# Altium project Frequency_REF_Module.PrjPCB
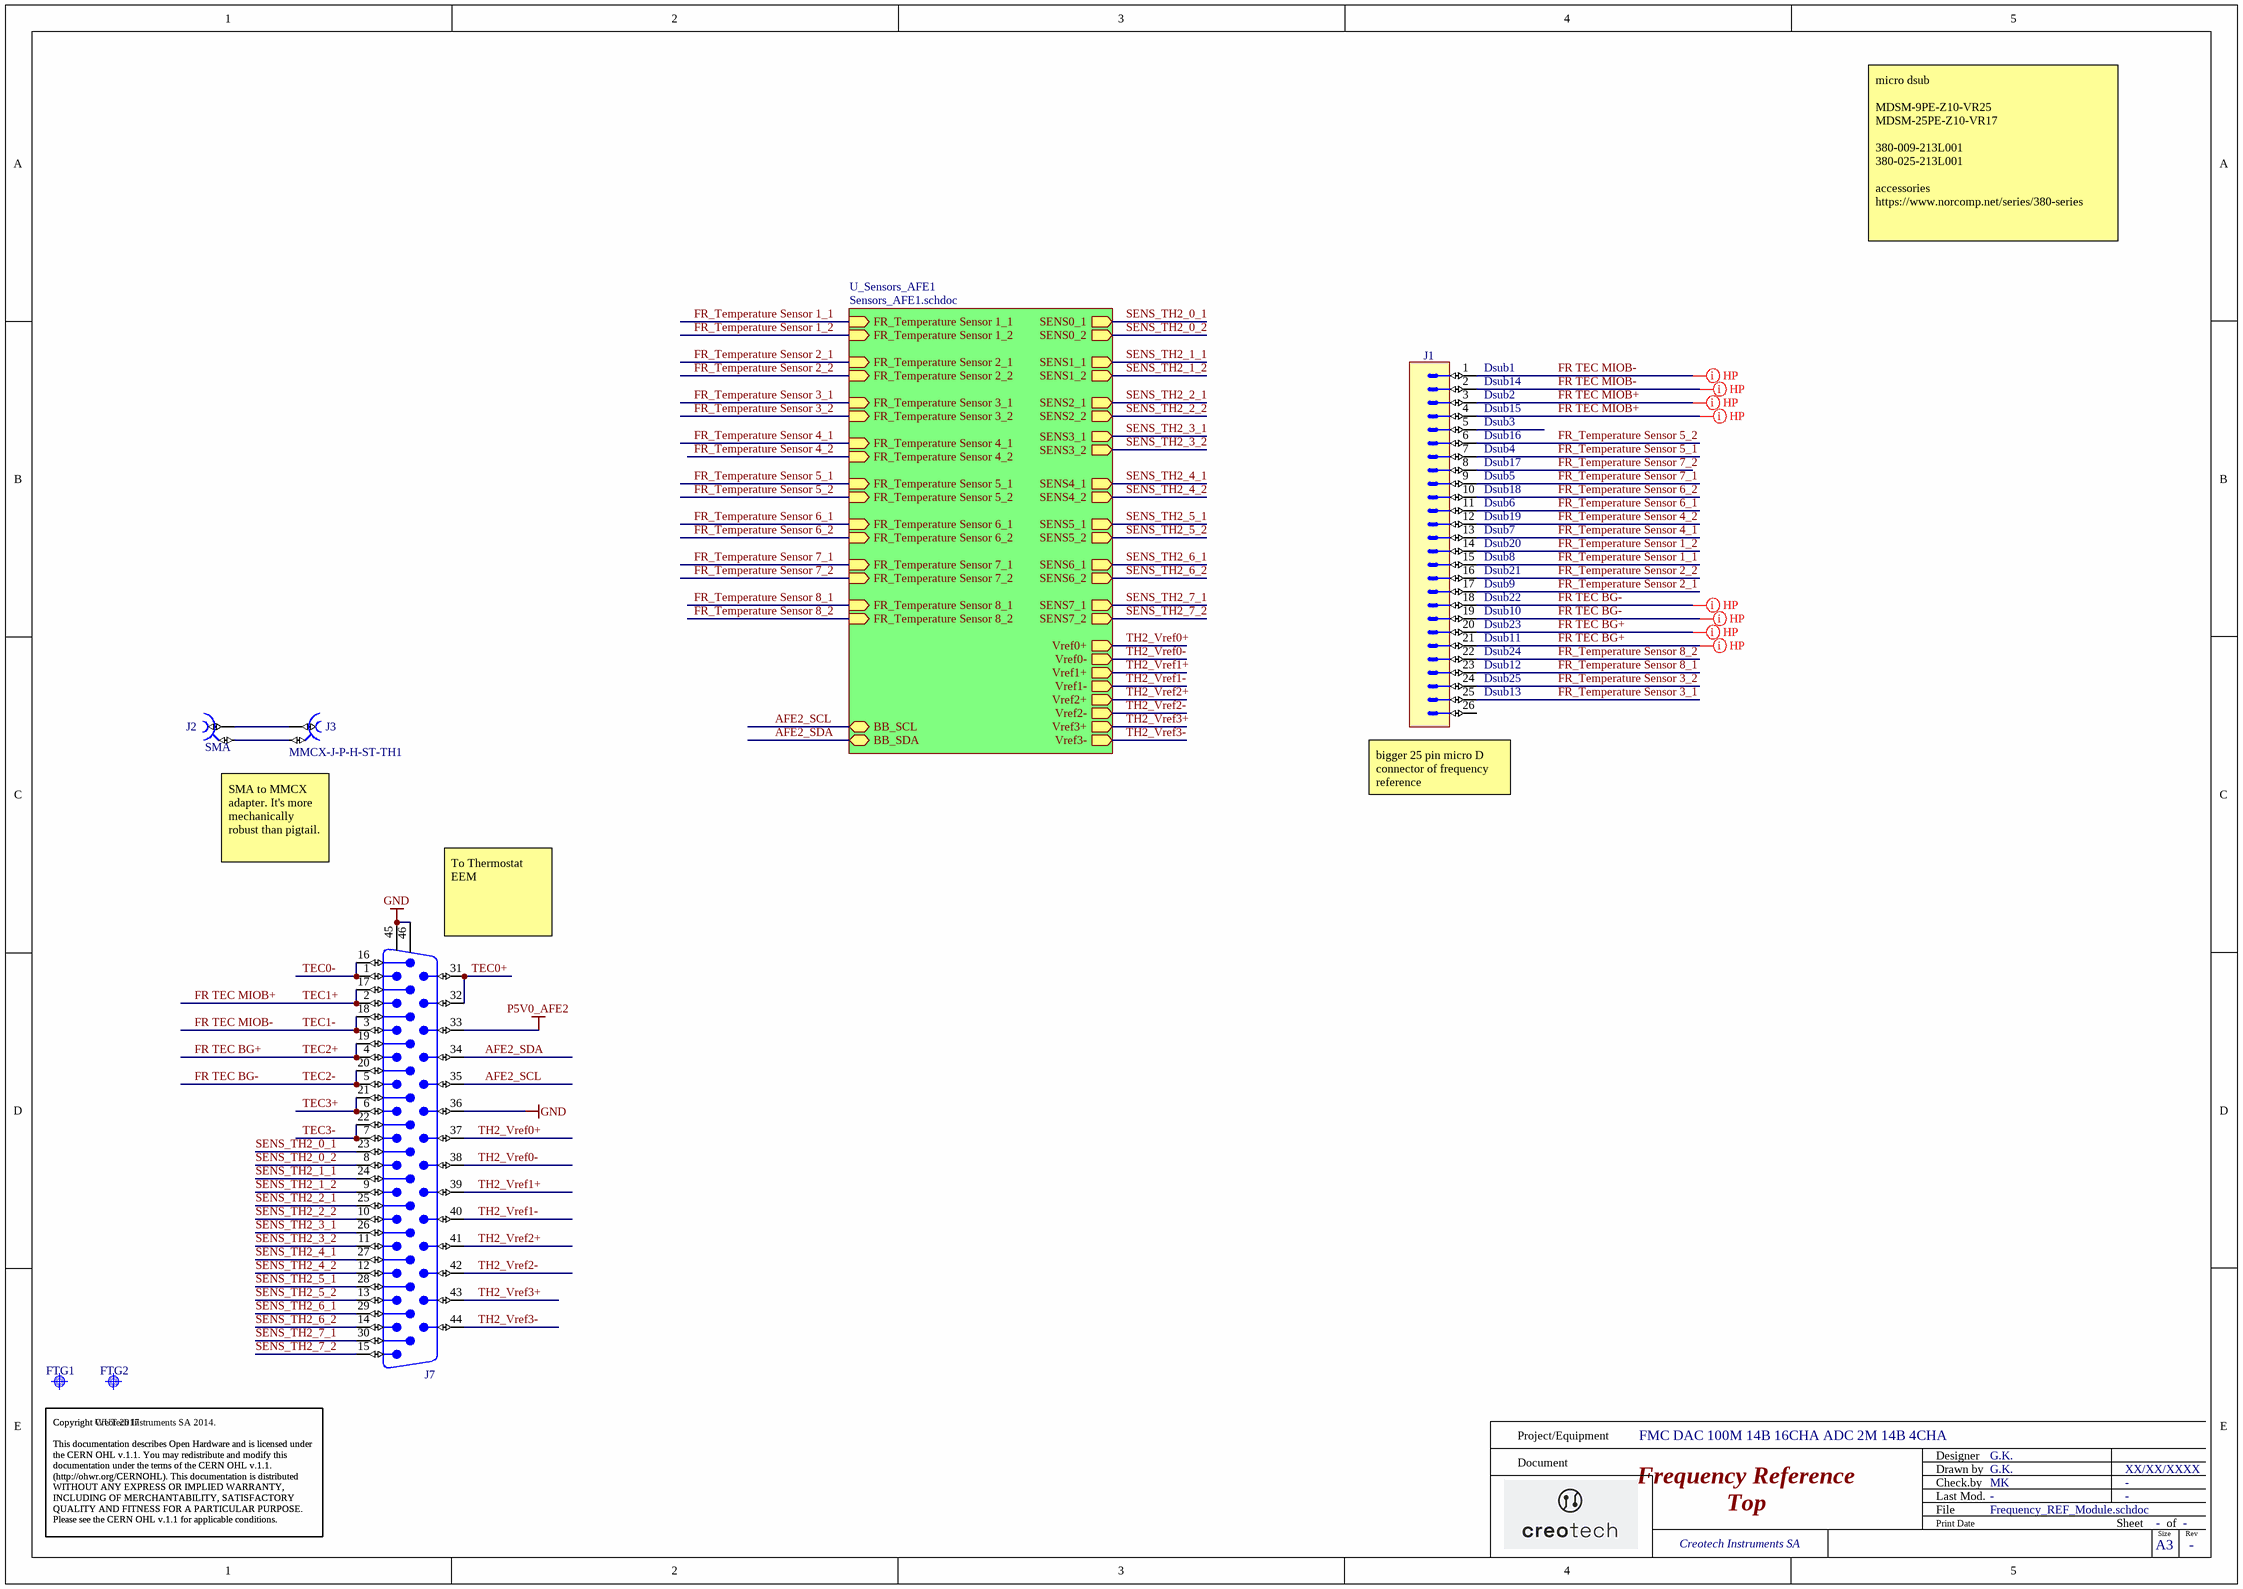
[diagram p0: Frequency_REF_Module.schdoc]
2 sheets, 49 parts. Net scope: hierarchical (ports join the sheet entries above them; power ports are global).
Board file: Frequency_REF_Module.PCBDOC
Sheets:
  Frequency_REF_Module.schdoc
    U_Sensors_AFE1 = Sensors_AFE1.schdoc

## Sheet Frequency_REF_Module.schdoc: Frequency Reference
size 420 x 297 mm; EDA_Number: ARTIQ; Projet: KASLI 3U subsystem; CheckedBy: MK; Author: G.K.; CompanyName: CREOTECH; DrawnBy: G.K.; Organization: CTI SA; Address1: Creotech Instruments SA; Address2: Okulickiego 7/9, 05-500 Poland; Revision: -; SheetNumber: -; SheetTotal: -; ModifiedBy: -; CreateDate: XX/XX/XXXX; CheckedDate: -; Title2: Top; DivGrp: CTI; Designer: G.K.; ModifiedDate: -; ProjectName: FMC DAC 100M 14B 16CHA ADC 2M 14B 4CHA

### Parts
FTG1  Use only in PCB  [FIDUCIAL_TOP_C100-200]  (value not drawn)
FTG2  Use only in PCB  [FIDUCIAL_TOP_S100-200]  (value not drawn)
J1  Header 26  [3M_N2526-6002RB]  (value not drawn)
J2  SMA  [DELOCK_65848]
J3  Manufacturer Part Number: MMCX-J-P-H-ST-TH1  [SAMTEC_MMCX-J-P-H-ST-TH1]  (hidden comment: Coax_1Female_1Shield)
J7  D-Sub  [AMPHENOL_10090926-P444XLF]  (value not drawn)

### Sub-sheets
U_Sensors_AFE1 = Sensors_AFE1.schdoc: SENS0_1 (out), SENS0_2 (out), SENS1_1 (out), SENS1_2 (out), SENS2_1 (out), SENS2_2 (out), SENS3_1 (out), SENS3_2 (out), SENS4_1 (out), SENS4_2 (out), SENS5_1 (out), SENS5_2 (out), SENS6_1 (out), SENS6_2 (out), SENS7_1 (out), SENS7_2 (out), Vref0+ (out), Vref0- (out), Vref1+ (out), Vref1- (out), Vref2+ (out), Vref2- (out), Vref3+ (out), Vref3- (out), BB_SCL (bidir), BB_SDA (bidir), FR_Temperature Sensor 1_2 (in), FR_Temperature Sensor 2_2 (in), FR_Temperature Sensor 1_1 (in), FR_Temperature Sensor 2_1 (in), FR_Temperature Sensor 3_1 (in), FR_Temperature Sensor 3_2 (in), FR_Temperature Sensor 4_1 (in), FR_Temperature Sensor 4_2 (in), FR_Temperature Sensor 5_1 (in), FR_Temperature Sensor 5_2 (in), FR_Temperature Sensor 6_1 (in), FR_Temperature Sensor 6_2 (in), FR_Temperature Sensor 7_1 (in), FR_Temperature Sensor 7_2 (in), FR_Temperature Sensor 8_1 (in), FR_Temperature Sensor 8_2 (in)

### Nets
GND: J7.36 J7.45 J7.46
P5V0_AFE2: J7.33
AFE2_SCL: J7.35 ; sheet U_Sensors_AFE1/BB_SCL
AFE2_SDA: J7.34 ; sheet U_Sensors_AFE1/BB_SDA
FR TEC BG+: J1.20 J1.21 J7.4 J7.19  [also labelled TEC2+]
FR TEC BG-: J1.18 J1.19 J7.5 J7.20  [also labelled TEC2-]
FR TEC MIOB+: J1.3 J1.4 J7.2 J7.17  [also labelled TEC1+]
FR TEC MIOB-: J1.1 J1.2 J7.3 J7.18  [also labelled TEC1-]
FR_Temperature Sensor 1_1: J1.15 J7.23 ; sheet U_Sensors_AFE1/SENS0_1, sheet U_Sensors_AFE1/FR_Temperature Sensor 1_1  [also labelled SENS_TH2_0_1]
FR_Temperature Sensor 1_2: J1.14 J7.8 ; sheet U_Sensors_AFE1/SENS0_2, sheet U_Sensors_AFE1/FR_Temperature Sensor 1_2  [also labelled SENS_TH2_0_2]
FR_Temperature Sensor 2_1: J1.17 J7.24 ; sheet U_Sensors_AFE1/SENS1_1, sheet U_Sensors_AFE1/FR_Temperature Sensor 2_1  [also labelled SENS_TH2_1_1]
FR_Temperature Sensor 2_2: J1.16 J7.9 ; sheet U_Sensors_AFE1/SENS1_2, sheet U_Sensors_AFE1/FR_Temperature Sensor 2_2  [also labelled SENS_TH2_1_2]
FR_Temperature Sensor 3_1: J1.25 J7.25 ; sheet U_Sensors_AFE1/SENS2_1, sheet U_Sensors_AFE1/FR_Temperature Sensor 3_1  [also labelled SENS_TH2_2_1]
FR_Temperature Sensor 3_2: J1.24 J7.10 ; sheet U_Sensors_AFE1/SENS2_2, sheet U_Sensors_AFE1/FR_Temperature Sensor 3_2  [also labelled SENS_TH2_2_2]
FR_Temperature Sensor 4_1: J1.13 J7.26 ; sheet U_Sensors_AFE1/SENS3_1, sheet U_Sensors_AFE1/FR_Temperature Sensor 4_1  [also labelled SENS_TH2_3_1]
FR_Temperature Sensor 4_2: J1.12 J7.11 ; sheet U_Sensors_AFE1/SENS3_2, sheet U_Sensors_AFE1/FR_Temperature Sensor 4_2  [also labelled SENS_TH2_3_2]
FR_Temperature Sensor 5_1: J1.7 J7.27 ; sheet U_Sensors_AFE1/SENS4_1, sheet U_Sensors_AFE1/FR_Temperature Sensor 5_1  [also labelled SENS_TH2_4_1]
FR_Temperature Sensor 5_2: J1.6 J7.12 ; sheet U_Sensors_AFE1/SENS4_2, sheet U_Sensors_AFE1/FR_Temperature Sensor 5_2  [also labelled SENS_TH2_4_2]
FR_Temperature Sensor 6_1: J1.11 J7.28 ; sheet U_Sensors_AFE1/SENS5_1, sheet U_Sensors_AFE1/FR_Temperature Sensor 6_1  [also labelled SENS_TH2_5_1]
FR_Temperature Sensor 6_2: J1.10 J7.13 ; sheet U_Sensors_AFE1/SENS5_2, sheet U_Sensors_AFE1/FR_Temperature Sensor 6_2  [also labelled SENS_TH2_5_2]
FR_Temperature Sensor 7_1: J1.9 J7.29 ; sheet U_Sensors_AFE1/SENS6_1, sheet U_Sensors_AFE1/FR_Temperature Sensor 7_1  [also labelled SENS_TH2_6_1]
FR_Temperature Sensor 7_2: J1.8 J7.14 ; sheet U_Sensors_AFE1/SENS6_2, sheet U_Sensors_AFE1/FR_Temperature Sensor 7_2  [also labelled SENS_TH2_6_2]
FR_Temperature Sensor 8_1: J1.23 J7.30 ; sheet U_Sensors_AFE1/SENS7_1, sheet U_Sensors_AFE1/FR_Temperature Sensor 8_1  [also labelled SENS_TH2_7_1]
FR_Temperature Sensor 8_2: J1.22 J7.15 ; sheet U_Sensors_AFE1/SENS7_2, sheet U_Sensors_AFE1/FR_Temperature Sensor 8_2  [also labelled SENS_TH2_7_2]
TEC0+: J7.31 J7.32
TEC0-: J7.1 J7.16
TEC3+: J7.6 J7.21
TEC3-: J7.7 J7.22
TH2_Vref0+: J7.37 ; sheet U_Sensors_AFE1/Vref0+
TH2_Vref0-: J7.38 ; sheet U_Sensors_AFE1/Vref0-
TH2_Vref1+: J7.39 ; sheet U_Sensors_AFE1/Vref1+
TH2_Vref1-: J7.40 ; sheet U_Sensors_AFE1/Vref1-
TH2_Vref2+: J7.41 ; sheet U_Sensors_AFE1/Vref2+
TH2_Vref2-: J7.42 ; sheet U_Sensors_AFE1/Vref2-
TH2_Vref3+: J7.43 ; sheet U_Sensors_AFE1/Vref3+
TH2_Vref3-: J7.44 ; sheet U_Sensors_AFE1/Vref3-
NetJ2_1: J2.1 J3.1
NetJ2_2: J2.2 J3.2

Not connected (* = marked no-connect by the designer): J1 5 26

### Layout directives
net class HP: FR TEC BG+, FR TEC BG-, FR TEC MIOB+, FR TEC MIOB-

### Notes on the sheet
- micro dsub
  MDSM-9PE-Z10-VR25
  MDSM-25PE-Z10-VR17
  380-009-213L001
  380-025-213L001
  accessories
  https://www.norcomp.net/series/380-series
- (near J1) Dsub1
- (near J1) Dsub2
- (near J1) Dsub14
- (near J1) Dsub3
- (near J1) Dsub4
- (near J1) Dsub15
- (near J1) Dsub16
- (near J1) Dsub5
- (near J1) Dsub6
- (near J1) Dsub7
- (near J1) Dsub17
- (near J1) Dsub18
- (near J1) Dsub19
- (near J1) Dsub8
- (near J1) Dsub9
- (near J1) Dsub20
- (near J1) Dsub21
- (near J1) Dsub10
- (near J1) Dsub11
- (near J1) Dsub12
- (near J1) Dsub22
- (near J1) Dsub23
- (near J1) Dsub24
- (near J1) Dsub13
- (near J1) Dsub25
- (near J1) bigger 25 pin micro D connector of frequency reference
- SMA to MMCX adapter. It's more mechanically robust than pigtail.
- (near J7) To Thermostat EEM
- Copyright WUT 2017
  This documentation describes Open Hardware and is licensed under the CERN OHL v.1.1. You may redistribute and modify this documentation under the terms of the CERN OHL v.1.1. (http://ohwr.org/CERNOHL). This documentation is distributed WITHOUT ANY EXPRESS OR IMPLIED WARRANTY, INCLUDING OF MERCHANTABILITY, SATISFACTORY QUALITY AND FITNESS FOR A PARTICULAR PURPOSE. Please see the CERN OHL v.1.1 for applicable conditions.
- Project/Equipment
- Document
- Designer
- Drawn by
- Check.by
- Copyright Creotech Instruments SA 2014.
  This documentation describes Open Hardware and is licensed under the CERN OHL v.1.1. You may redistribute and modify this documentation under the terms of the CERN OHL v.1.1. (http://ohwr.org/CERNOHL). This documentation is distributed WITHOUT ANY EXPRESS OR IMPLIED WARRANTY, INCLUDING OF MERCHANTABILITY, SATISFACTORY QUALITY AND FITNESS FOR A PARTICULAR PURPOSE. Please see the CERN OHL v.1.1 for applicable conditions.
- File
- Last Mod.
- Print Date
- Sheet
- Size
- A3
- of
- Rev

### Library data of the parts
FTG1 = FIDUCIAL_TARGET_C100-200: Fiducial Target; Part Description: Round Fiducial Target, Top Layer, 1.0mm, Top Solder 2.0mm, Keepout =2.0mm; Mounted: No; Part Number: FIDUCIAL_TARGET_C100-200; Component Kind: Standard (No BOM); Component Type: Standard (No BOM); Pin Count: 1; Family: Fiducial; Socket: No; SMD: Yes; Sense: No; Status: None; ComponentHeight: 0mm; HelpURL: Undefined; Author: CERN DEM JLC; CreateDate: 09.02.2010; LatestRevisionDate: 04.04.2012; PackageDescription: Round Fiducial Target, Top Layer, 1.0mm, Top Solder 2.0mm, Keepout =2.0mm
FTG2 = FIDUCIAL_TARGET_S100-200: Fiducial Target; Part Description: Square Fiducial Target, Top Layer, 1.0mm, Top Solder 2.0mm, Keepout =2.0mm; Mounted: No; Part Number: FIDUCIAL_TARGET_S100-200; Component Kind: Standard (No BOM); Component Type: Standard (No BOM); Pin Count: 1; Family: Fiducial; Socket: No; SMD: Yes; Sense: No; Status: None; ComponentHeight: 0mm; HelpURL: Undefined; Author: CERN DEM JLC; CreateDate: 09.02.2010; LatestRevisionDate: 04.04.2012; PackageDescription: Square Fiducial Target, Top Layer, 1.0mm, Top Solder 2.0mm, Keepout =2.0mm
J1 = 3M_N2526-6002RB: Connector 26 Male; Part Description: 26 Contacts, Straight .100'' x .100'' Low Profile Four-Wall Header, 2500 Series; Manufacturer: 3M; PressFit: No; Part Number: 3M_N2526-6002RB; Component Kind: Standard; Component Type: Standard; Pin Count: 26; Family: Header 26; Mounted: Yes; Socket: No; SMD: No; Sense: No; Status: None; Manufacturer Part Number: N2526-6002RB; ComponentHeight: 10.03mm; HelpURL: \\cern.ch\dfs\Applications\Altium\Datasheets\3M_N2526-6002RB.pdf; Author: CERN DEM JLC; CreateDate: 11.02.2009; LatestRevisionDate: 11.08.2009
J2 = CON_SMA_DELOCK_65848: 50 Ohm Through Hole SMA Right Angle PCB Jack; Manufacturer: DELOCK; Manufacturer Part Number: 5848 (4043619658480); PressFit: No; Part Number: DELOCK_65848; Component Kind: Standard; Component Type: Standard; Pin Count: 5; Family: SMA; Mounted: Yes; Socket: No; SMD: No; Sense: No; Status: None; Part Description: 50 Ohm Through Hole SMA Right Angle PCB Jack; ComponentHeight: 12.5; HelpURL: \\cern.ch\dfs\Applications\Altium\Datasheets\AMPHENOL_132203-16.pdf; Author: GK; CreateDate: 13.05.2019; LatestRevisionDate: 13.05.2019
J3 = SAMTEC_MMCX-J-P-H-ST-TH1: Part Description: Straight Through-hole 50 Ohm Micro Mini RF Jack, MMCX Series; Manufacturer: SAMTEC; PressFit: No; Part Number: SAMTEC_MMCX-J-P-H-ST-TH1; Component Kind: Standard; Component Type: Standard; Pin Count: 2; Mounted: Yes; Socket: No; SMD: No; Sense: No; Status: None; ComponentHeight: 4.35mm; HelpURL: \\cern.ch\dfs\Applications\Altium\Datasheets\SAMTEC_MMCX-J-P-H-ST-TH1.pdf; Author: CERN DEM JLC; CreateDate: 05.12.2012; LatestRevisionDate: 05.12.2012
J7 = AMPHENOL_10090926-P444XLF: Connector D-sub 44 Male; Part Description: Right Angle High Density D-sub 44 Male Contacts with Harpoons + UNC 4-40 Clinchnuts + Electrical Continuity; PressFit: No; Part Number: AMPHENOL_10090926-P444XLF; Component Kind: Standard; Component Type: Standard; Pin Count: 46; Family: D-Sub; Mounted: Yes; Socket: No; SMD: No; Sense: No; Status: None; Manufacturer: AMPHENOL; Manufacturer Part Number: 10090926-P444XLF; ComponentHeight: 12.8mm; HelpURL: \\cern.ch\dfs\Applications\Altium\Datasheets\AMPHENOL_10090926-P444XLF.pdf; Author: CERN DEM BC; CreateDate: 22.10.2020; LatestRevisionDate: 22.10.2020

## Sheet Sensors_AFE1.schdoc: FR sensors
size 420 x 297 mm; EDA_Number: ARTIQ; Projet: KASLI 3U subsystem; CheckedBy: MK; Author: G.K.; CompanyName: CREOTECH; DrawnBy: G.K.; Organization: CTI SA; Address1: Creotech Instruments SA; Address2: Okulickiego 7/9, 05-500 Poland; Revision: -; SheetNumber: -; SheetTotal: -; ModifiedBy: -; CreateDate: XX/XX/XXXX; CheckedDate: -; DivGrp: CTI; Designer: G.K.; ModifiedDate: -; ProjectName: FMC DAC 100M 14B 16CHA ADC 2M 14B 4CHA
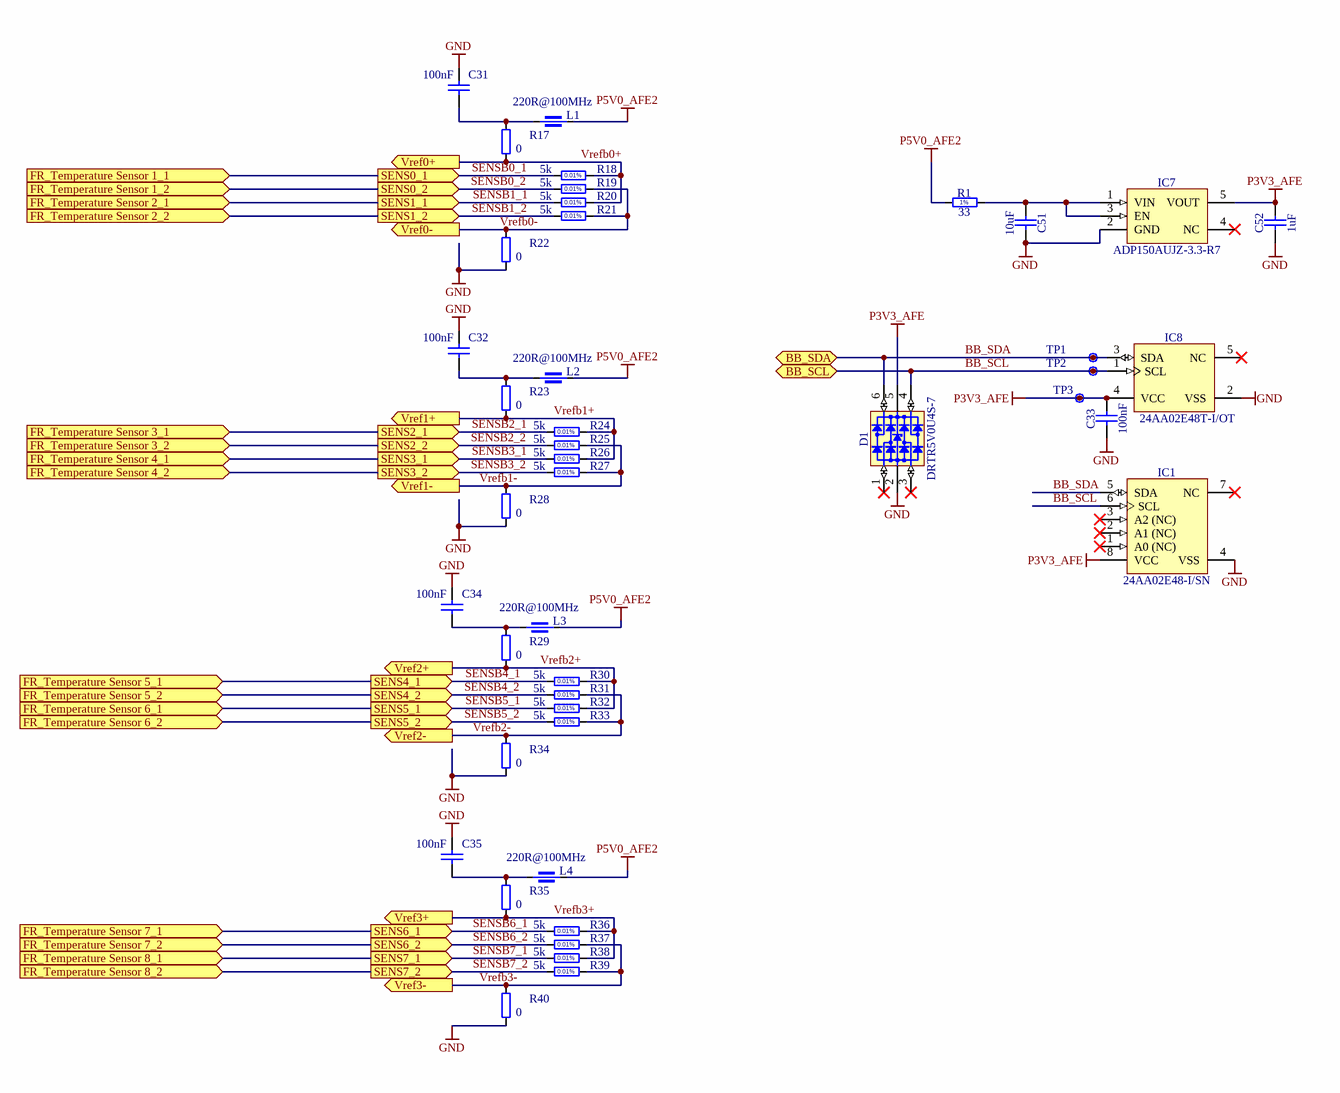
[diagram p1: Sensors_AFE1.schdoc]

### Parts
C31  100nF  [CAPC1005X55N]
C32  100nF  [CAPC1005X55N]
C33  100nF  [CAPC1005X55N]
C34  100nF  [CAPC1005X55N]
C35  100nF  [CAPC1005X55N]
C51  10uF  [CAPC2012X135N]
C52  1uF  [CAPC1608X87N]
D1  DRTR5V0U4S-7  [SOT65P210X110-6N]
IC1  24AA02E48-I/SN  [SOIC127P600X175-8N]
IC7  ADP150AUJZ-3.3-R7  [SOT95P280X90-5N]
IC8  24AA02E48T-I/OT  [SOT95P280X145-5N]
L1  220R@100MHz  [INDC1005X55N]
L2  220R@100MHz  [INDC1005X55N]
L3  220R@100MHz  [INDC1005X55N]
L4  220R@100MHz  [INDC1005X55N]
R1  33  [RESC1005X40N]
R17  0  [RESC1608X55N]
R18  5k  [RESC2013X64N]
R19  5k  [RESC2013X64N]
R20  5k  [RESC2013X64N]
R21  5k  [RESC2013X64N]
R22  0  [RESC1608X55N]
R23  0  [RESC1608X55N]
R24  5k  [RESC2013X64N]
R25  5k  [RESC2013X64N]
R26  5k  [RESC2013X64N]
R27  5k  [RESC2013X64N]
R28  0  [RESC1608X55N]
R29  0  [RESC1608X55N]
R30  5k  [RESC2013X64N]
R31  5k  [RESC2013X64N]
R32  5k  [RESC2013X64N]
R33  5k  [RESC2013X64N]
R34  0  [RESC1608X55N]
R35  0  [RESC1608X55N]
R36  5k  [RESC2013X64N]
R37  5k  [RESC2013X64N]
R38  5k  [RESC2013X64N]
R39  5k  [RESC2013X64N]
R40  0  [RESC1608X55N]
TP1  Test Point  [TPS127]  (value not drawn)
TP2  Test Point  [TPS127]  (value not drawn)
TP3  Test Point  [TPS127]  (value not drawn)

### Ports
BB_SCL (bidir), BB_SDA (bidir), FR_Temperature Sensor 1_1 (in), FR_Temperature Sensor 1_2 (in), FR_Temperature Sensor 2_1 (in), FR_Temperature Sensor 2_2 (in), FR_Temperature Sensor 3_1 (in), FR_Temperature Sensor 3_2 (in), FR_Temperature Sensor 4_1 (in), FR_Temperature Sensor 4_2 (in), FR_Temperature Sensor 5_1 (in), FR_Temperature Sensor 5_2 (in), FR_Temperature Sensor 6_1 (in), FR_Temperature Sensor 6_2 (in), FR_Temperature Sensor 7_1 (in), FR_Temperature Sensor 7_2 (in), FR_Temperature Sensor 8_1 (in), FR_Temperature Sensor 8_2 (in), SENS0_1 (out), SENS0_2 (out), SENS1_1 (out), SENS1_2 (out), SENS2_1 (out), SENS2_2 (out), SENS3_1 (out), SENS3_2 (out), SENS4_1 (out), SENS4_2 (out), SENS5_1 (out), SENS5_2 (out), SENS6_1 (out), SENS6_2 (out), SENS7_1 (out), SENS7_2 (out), Vref0+ (out), Vref0- (out), Vref1+ (out), Vref1- (out), Vref2+ (out), Vref2- (out), Vref3+ (out), Vref3- (out)

### Nets
GND: C31.1 C32.1 C33.1 C34.1 C35.1 C51.2 C52.1 D1.2(GND) IC1.4(VSS) IC7.2(GND) IC8.2(VSS) R22.1 R28.1 R34.1 R40.1
P3V3_AFE: C33.2 C52.2 D1.5(VBUS) IC1.8(VCC) IC7.5(VOUT) IC8.4(VCC) TP3.1
P5V0_AFE2: L1.2 L2.2 L3.2 L4.2 R1.1
BB_SCL: D1.4(I/O3) IC1.6(SCL) IC8.1(SCL) TP2.1 ; port BB_SCL  [project net AFE2_SCL]
BB_SDA: D1.6(I/O4) IC1.5(SDA) IC8.3(SDA) TP1.1 ; port BB_SDA  [project net AFE2_SDA]
SENSB0_1: R18.1 ; port SENS0_1, port FR_Temperature Sensor 1_1  [project net FR_Temperature Sensor 1_1]
SENSB0_2: R19.1 ; port SENS0_2, port FR_Temperature Sensor 1_2  [project net FR_Temperature Sensor 1_2]
SENSB1_1: R20.1 ; port SENS1_1, port FR_Temperature Sensor 2_1  [project net FR_Temperature Sensor 2_1]
SENSB1_2: R21.1 ; port SENS1_2, port FR_Temperature Sensor 2_2  [project net FR_Temperature Sensor 2_2]
SENSB2_1: R24.1 ; port SENS2_1, port FR_Temperature Sensor 3_1  [project net FR_Temperature Sensor 3_1]
SENSB2_2: R25.1 ; port SENS2_2, port FR_Temperature Sensor 3_2  [project net FR_Temperature Sensor 3_2]
SENSB3_1: R26.1 ; port SENS3_1, port FR_Temperature Sensor 4_1  [project net FR_Temperature Sensor 4_1]
SENSB3_2: R27.1 ; port SENS3_2, port FR_Temperature Sensor 4_2  [project net FR_Temperature Sensor 4_2]
SENSB4_1: R30.1 ; port SENS4_1, port FR_Temperature Sensor 5_1  [project net FR_Temperature Sensor 5_1]
SENSB4_2: R31.1 ; port SENS4_2, port FR_Temperature Sensor 5_2  [project net FR_Temperature Sensor 5_2]
SENSB5_1: R32.1 ; port SENS5_1, port FR_Temperature Sensor 6_1  [project net FR_Temperature Sensor 6_1]
SENSB5_2: R33.1 ; port SENS5_2, port FR_Temperature Sensor 6_2  [project net FR_Temperature Sensor 6_2]
SENSB6_1: R36.1 ; port SENS6_1, port FR_Temperature Sensor 7_1  [project net FR_Temperature Sensor 7_1]
SENSB6_2: R37.1 ; port SENS6_2, port FR_Temperature Sensor 7_2  [project net FR_Temperature Sensor 7_2]
SENSB7_1: R38.1 ; port SENS7_1, port FR_Temperature Sensor 8_1  [project net FR_Temperature Sensor 8_1]
SENSB7_2: R39.1 ; port SENS7_2, port FR_Temperature Sensor 8_2  [project net FR_Temperature Sensor 8_2]
Vrefb0+: R17.1 R18.2 R20.2 ; port Vref0+  [project net TH2_Vref0+]
Vrefb0-: R19.2 R21.2 R22.2 ; port Vref0-  [project net TH2_Vref0-]
Vrefb1+: R23.1 R24.2 R26.2 ; port Vref1+  [project net TH2_Vref1+]
Vrefb1-: R25.2 R27.2 R28.2 ; port Vref1-  [project net TH2_Vref1-]
Vrefb2+: R29.1 R30.2 R32.2 ; port Vref2+  [project net TH2_Vref2+]
Vrefb2-: R31.2 R33.2 R34.2 ; port Vref2-  [project net TH2_Vref2-]
Vrefb3+: R35.1 R36.2 R38.2 ; port Vref3+  [project net TH2_Vref3+]
Vrefb3-: R37.2 R39.2 R40.2 ; port Vref3-  [project net TH2_Vref3-]
NetC31_2: C31.2 L1.1 R17.2
NetC32_2: C32.2 L2.1 R23.2
NetC34_2: C34.2 L3.1 R29.2
NetC35_2: C35.2 L4.1 R35.2
NetC51_1: C51.1 IC7.1(VIN) IC7.3(EN) R1.2

Not connected (* = marked no-connect by the designer): D1 1(I/O1)* 3(I/O2)*; IC1 1(A0_(NC))* 2(A1_(NC))* 3(A2_(NC))* 7(NC)*; IC7 4(NC)*; IC8 5(NC)*

### Notes on the sheet
- Project/Equipment
- Document
- Designer
- Drawn by
- Check.by
- Copyright Creotech Instruments SA 2014.
  This documentation describes Open Hardware and is licensed under the CERN OHL v.1.1. You may redistribute and modify this documentation under the terms of the CERN OHL v.1.1. (http://ohwr.org/CERNOHL). This documentation is distributed WITHOUT ANY EXPRESS OR IMPLIED WARRANTY, INCLUDING OF MERCHANTABILITY, SATISFACTORY QUALITY AND FITNESS FOR A PARTICULAR PURPOSE. Please see the CERN OHL v.1.1 for applicable conditions.
- File
- Last Mod.
- Print Date
- Sheet
- Size
- A3
- of
- Rev
- (in symbol R0402_33R_1%_0.0625W_100PPM) 1%
- (in symbol R0805_5K_0.01%_0.2W_0.2PPM_VISHAY_VSMP) 0.01%

### Library data of the parts
C31-C35 = CC0402_100NF_16V_10%_X5R: Non-polarised capacitor; Part Description: SMD Multilayer Chip Ceramic Capacitor; Manufacturer: GENERIC; Manufacturer1 Part Number: GRM155R61C104KA88D; Voltage: 16V; TC: X5R; Tolerance: ±10%; Part Number: CC0402_100NF_16V_10%_X5R; Component Kind: Standard; Component Type: Standard; Pin Count: 2; Value: 100nF; Status: None; Manufacturer Part Number: CC0402_100NF_16V_10%_X5R; Case: 0402; Mounted: Yes; Socket: No; SMD: Yes; Sense: No; Manufacturer1 Example: MURATA; Manufacturer1 ComponentHeight: 0.55mm; HelpURL: \\cern.ch\dfs\Applications\Altium\Datasheets\CC0402_X5R_MURATA_GRM.pdf; Author: CERN DEM JLC; CreateDate: 10.12.2013; LatestRevisionDate: 10.12.2013
C51 = CC0805_10UF_16V_10%_X5R: Non-polarised capacitor; Part Description: SMD Multilayer Chip Ceramic Capacitor; Manufacturer: GENERIC; Manufacturer1 Part Number: C0805C106K4PAC; Voltage: 16V; TC: X5R; Tolerance: ±10%; Part Number: CC0805_10UF_16V_10%_X5R; Component Kind: Standard; Component Type: Standard; Pin Count: 2; Value: 10uF; Status: Preferred; Manufacturer Part Number: CC0805_10UF_16V_10%_X5R; Case: 0805; Mounted: Yes; Socket: No; SMD: Yes; Manufacturer1 Example: KEMET; Manufacturer1 ComponentHeight: 1.4mm; HelpURL: \\cern.ch\dfs\Applications\Altium\Datasheets\CC1206_X5R_KEMET.pdf; Author: CERN DEM JLC; CreateDate: 03.12.2007; LatestRevisionDate: 03.12.2007; Sense: No
C52 = CC0603_1UF_25V_10%_X7R: Non-polarised capacitor; Part Description: SMD Multilayer Chip Ceramic Capacitor; Manufacturer: GENERIC; Manufacturer1 Part Number: GRM188R71E105KA12D; Voltage: 25V; TC: X7R; Tolerance: ±10%; Part Number: CC0603_1UF_25V_10%_X7R; Component Kind: Standard; Component Type: Standard; Pin Count: 2; Value: 1uF; Status: None; Manufacturer Part Number: CC0603_1UF_25V_10%_X7R; Case: 0603; Mounted: Yes; Socket: No; SMD: Yes; Sense: No; Manufacturer1 Example: MURATA; Manufacturer1 ComponentHeight: 0.9mm; HelpURL: \\cern.ch\dfs\Applications\Altium\Datasheets\CC0603_X7R_MURATA.pdf; Author: CERN DEM JLC; CreateDate: 18/01/2011; LatestRevisionDate: 18/01/2011
D1 = D_TVS_DRTR5V0U4S-7: Integrated Quad Ultra-Low Capacitance ESD Protection; Part Description: Integrated Quad Ultra-Low Capacitance ESD (±8kV) Protection; Manufacturer: DIODES; PressFit: No; Bonding: No; Status Comment: Active; Part Number: DRTR5V0U4S-7; Component Kind: Standard; Component Type: Standard; Device: DRTR5V0U4S-7; PackageDescription: SOT363, SC70-6, 0.65mm Pitch; 6 Pin, 1.25mm W X 2.00mm L X 1.10mm H body, IPC Medium Density; Status: Active; Manufacturer Part Number: DRTR5V0U4S-7; Pin Count: 6; Case: SOT363; Mounted: Yes; Socket: No; SMD: Yes; Sense: No; ComponentHeight: 1.1mm; HelpURL: \\cern.ch\dfs\Applications\Altium\Datasheets\PRTR5V0U4Y.pdf; Author: GK; CreateDate: 24.01.2017; LatestRevisionDate: 14.09.2020
IC1 = MEM_24AA02E48-I/SN: 1.7V-5.5V, 2K I2C™ Serial EEPROMs with EUI-48™ Node Identity; Manufacturer: MICROCHIP TECHNOLOGY; PressFit: No; Bonding: No; Part Number: 24AA02E48-I/SN; Component Kind: Standard; Component Type: Standard; Device: 24AA02E48-I/SN; PackageDescription: SOIC, 1.27mm Pitch; 8 Pin - Body 4x5mm, IPC Medium Density; Part Description: 1.7V-5.5V, 2K I2C™ Serial EEPROMs with EUI-48™ Node Identity; Manufacturer Part Number: 24AA02E48-I/SN; Pin Count: 8; Case: SOIC8; Mounted: Yes; Socket: No; SMD: Yes; Sense: No; ComponentHeight: 1.75mm; HelpURL: \\cern.ch\dfs\Applications\Altium\Datasheets\24AA025E48-I-SN.pdf; Author: CERN DEM MR; CreateDate: 19.07.2016; LatestRevisionDate: 19.07.2016
IC7 = ADP150AUJZ-3.3-R7: Ultralow Noise, 150 mA CMOS Linear Regulator; Part Description: 3.3V, 150mA, Ultralow Noise, CMOS Linear Regulator; Manufacturer: ANALOG DEVICES; PressFit: No; Bonding: No; Part Number: ADP150AUJZ-3.3-R7; Component Kind: Standard; Component Type: Standard; Device: ADP150AUJZ-3.3-R7; PackageDescription: SOT23, 0.95mm pitch; 5 pin, 1.75mm W X 3.00mm L, IPC Medium Density; Manufacturer Part Number: ADP150AUJZ-3.3-R7; Pin Count: 5; Case: SOT23; Mounted: Yes; Socket: No; SMD: Yes; Sense: No; ComponentHeight: 0.9mm; HelpURL: \\cern.ch\dfs\Applications\Altium\Datasheets\ADP150AUJZ-3.3-R7.pdf; Author: CERN DEM JLC; CreateDate: 27/09/2011; LatestRevisionDate: 19/06/2014
IC8 = 24AA02E48T-I/OT: 1.7V-5.5V, 2K I2C Serial EEPROM With EUI-48 Node Identity; Manufacturer: MICROCHIP TECHNOLOGY; PressFit: No; Bonding: No; Part Number: 24AA02E48T-I/OT; Component Kind: Standard; Component Type: Standard; Device: 24AA02E48T-I/OT; PackageDescription: SOT, 0.95mm pitch; 5 pin, 1.60mm W X 2.90mm L X 1.45mm H body, IPC Medium Density; Part Description: 1.7V-5.5V, 2K I2C Serial EEPROM With EUI-48 Node Identity; Manufacturer Part Number: 24AA02E48T-I/OT; Pin Count: 5; Case: SOT23-5; Mounted: Yes; Socket: No; SMD: Yes; Sense: No; ComponentHeight: 1.45mm; HelpURL: \\cern.ch\dfs\Applications\Altium\Datasheets\24AA02E48T-I-OT.pdf; Author: CERN DEM MR; CreateDate: 31.03.2016; LatestRevisionDate: 31.03.2016
L1-L4 = IND0402_MURATA_BLM15HB221SN1: Part Description: SMD EMIFIL Suppression Chip Ferrite Bead; Manufacturer: MURATA; Power: 250mA; Resistance: 1R; Tolerance: ±25%; Part Number: IND0402_MURATA_BLM15HB221SN1; Component Kind: Standard; Component Type: Standard; Pin Count: 2; Value: 220R@100MHz; Status: None; Manufacturer Part Number: BLM15HB221SN1; Case: 0402; Mounted: Yes; Socket: No; SMD: Yes; Sense: No; ComponentHeight: 0.55mm; HelpURL: \\cern.ch\dfs\Applications\Altium\Datasheets\IND0402_MURATA_BLM15H.pdf; Author: CERN DEM JLC; CreateDate: 23.06.2009; LatestRevisionDate: 25.10.2018
R1 = R0402_33R_1%_0.0625W_100PPM: Resistor - 1%; Part Description: General Purpose Thick Film Chip Resistor; Manufacturer: GENERIC; Manufacturer1 Part Number: 232270673309L; TC: ±100ppm/°C; PressFit: No; Part Number: R0402_33R_1%_0.0625W_100PPM; Component Kind: Standard; Component Type: Standard; Pin Count: 2; Value: 33; Status: Not Recommended; Power: 0.0625W; Tolerance: ±1%; Manufacturer Part Number: R0402_33R_1%_0.0625W_100PPM; Case: 0402; Mounted: Yes; Sense: No; Socket: No; SMD: Yes; Manufacturer1 Example: YAGEO PHYCOMP; Manufacturer1 ComponentHeight: 0.4mm; HelpURL: \\cern.ch\dfs\Applications\Altium\Datasheets\R0402_Phycomp_RC0402.pdf; Author: CERN DEM JLC; CreateDate: 03/12/2007; LatestRevisionDate: 17/10/2012
R17 R22 R23 R28 R29 R34 R35 R40 = R0603_0R_JUMPER: Resistor; Part Description: 1A (0.05R Max DC Resistance) Zero Ohm Jumper; Manufacturer: GENERIC; Manufacturer1 Part Number: NRC06Z0; PressFit: No; Part Number: R0603_0R_JUMPER; Component Kind: Standard; Component Type: Standard; Pin Count: 2; Value: 0; Status: Preferred; Manufacturer Part Number: R0603_0R_JUMPER; Case: 0603; Mounted: Yes; Sense: No; Socket: No; SMD: Yes; Manufacturer1 Example: NIC COMPONENT; Manufacturer1 ComponentHeight: 0.55mm; HelpURL: \\cern.ch\dfs\Applications\Altium\Datasheets\R0603_NIC_NRC.pdf; Author: CERN DEM JLC; CreateDate: 03.12.2007; LatestRevisionDate: 13.03.2008
R18-R21 R24-R27 R30-R33 R36-R39 = R0805_5K_0.01%_0.2W_0.2PPM_VISHAY_VSMP: Resistor - 0.01%; Part Description: Ultra High Precision Foil Wraparound Surface Mount Chip Resistor; Manufacturer: VISHAY PRECISION; Manufacturer Part Number: Y16245K00000T9R; Power: 0.2W; TC: ±0.2ppm/°C; PressFit: No; Part Number: R0805_5K_0.01%_0.2W_0.2PPM_VISHAY_VSMP; Component Kind: Standard; Component Type: Standard; Pin Count: 2; Value: 5k; Status: None; Tolerance: ±0.01%; Case: 0805; Mounted: Yes; Sense: No; Socket: No; SMD: Yes; Manufacturer1 ComponentHeight: 0.64mm; HelpURL: \\cern.ch\dfs\Applications\Altium\Datasheets\R0805_VISHAY_VSMP.pdf; Author: CERN DEM JLC; CreateDate: 22.09.2011; LatestRevisionDate: 22.09.2011
TP1-TP3 = SMD_PAD_1.27X1.27MM: Part Description: 1.27mm x 1.27mm PCB Copper Area (SMD Test Point); Mounted: No; Part Number: SMD_PAD_1.27X1.27MM; Component Kind: Standard (No BOM); Component Type: Standard (No BOM); Pin Count: 1; Family: Test Point; Socket: No; SMD: Yes; Sense: No; Status: None; ComponentHeight: 0mm; HelpURL: Undefined; Author: CERN DEM JLC; CreateDate: 12.01.2008; LatestRevisionDate: 12.01.2008; PackageDescription: 1.27mm x 1.27mm PCB Copper Area (SMD Test Point)

## Nets that join several sheets
GND: Frequency_REF_Module (J7.36 J7.45 J7.46), Sensors_AFE1 (15 pins)
P5V0_AFE2: Frequency_REF_Module (J7.33), Sensors_AFE1 (5 pins)
AFE2_SCL: Frequency_REF_Module (J7.35), Sensors_AFE1 (D1.4 IC1.6 IC8.1 TP2.1)
AFE2_SDA: Frequency_REF_Module (J7.34), Sensors_AFE1 (D1.6 IC1.5 IC8.3 TP1.1)
FR_Temperature Sensor 1_1: Frequency_REF_Module (J1.15 J7.23), Sensors_AFE1 (R18.1)
FR_Temperature Sensor 1_2: Frequency_REF_Module (J1.14 J7.8), Sensors_AFE1 (R19.1)
FR_Temperature Sensor 2_1: Frequency_REF_Module (J1.17 J7.24), Sensors_AFE1 (R20.1)
FR_Temperature Sensor 2_2: Frequency_REF_Module (J1.16 J7.9), Sensors_AFE1 (R21.1)
FR_Temperature Sensor 3_1: Frequency_REF_Module (J1.25 J7.25), Sensors_AFE1 (R24.1)
FR_Temperature Sensor 3_2: Frequency_REF_Module (J1.24 J7.10), Sensors_AFE1 (R25.1)
FR_Temperature Sensor 4_1: Frequency_REF_Module (J1.13 J7.26), Sensors_AFE1 (R26.1)
FR_Temperature Sensor 4_2: Frequency_REF_Module (J1.12 J7.11), Sensors_AFE1 (R27.1)
FR_Temperature Sensor 5_1: Frequency_REF_Module (J1.7 J7.27), Sensors_AFE1 (R30.1)
FR_Temperature Sensor 5_2: Frequency_REF_Module (J1.6 J7.12), Sensors_AFE1 (R31.1)
FR_Temperature Sensor 6_1: Frequency_REF_Module (J1.11 J7.28), Sensors_AFE1 (R32.1)
FR_Temperature Sensor 6_2: Frequency_REF_Module (J1.10 J7.13), Sensors_AFE1 (R33.1)
FR_Temperature Sensor 7_1: Frequency_REF_Module (J1.9 J7.29), Sensors_AFE1 (R36.1)
FR_Temperature Sensor 7_2: Frequency_REF_Module (J1.8 J7.14), Sensors_AFE1 (R37.1)
FR_Temperature Sensor 8_1: Frequency_REF_Module (J1.23 J7.30), Sensors_AFE1 (R38.1)
FR_Temperature Sensor 8_2: Frequency_REF_Module (J1.22 J7.15), Sensors_AFE1 (R39.1)
TH2_Vref0+: Frequency_REF_Module (J7.37), Sensors_AFE1 (R17.1 R18.2 R20.2)
TH2_Vref0-: Frequency_REF_Module (J7.38), Sensors_AFE1 (R19.2 R21.2 R22.2)
TH2_Vref1+: Frequency_REF_Module (J7.39), Sensors_AFE1 (R23.1 R24.2 R26.2)
TH2_Vref1-: Frequency_REF_Module (J7.40), Sensors_AFE1 (R25.2 R27.2 R28.2)
TH2_Vref2+: Frequency_REF_Module (J7.41), Sensors_AFE1 (R29.1 R30.2 R32.2)
TH2_Vref2-: Frequency_REF_Module (J7.42), Sensors_AFE1 (R31.2 R33.2 R34.2)
TH2_Vref3+: Frequency_REF_Module (J7.43), Sensors_AFE1 (R35.1 R36.2 R38.2)
TH2_Vref3-: Frequency_REF_Module (J7.44), Sensors_AFE1 (R37.2 R39.2 R40.2)

## Assembly variants
Default: not fitted IC8